# Altium schematic sheet PowerMeter_Meter.SchDoc: Power Meter - Measaurement
size A4; Author: SFARA, Gonzalo Agustín; CompanyName: Introducción al Diseño de Circuitos Impresos; Organization: UTN FRBA; Revision: 02; SheetNumber: 3; SheetTotal: 5
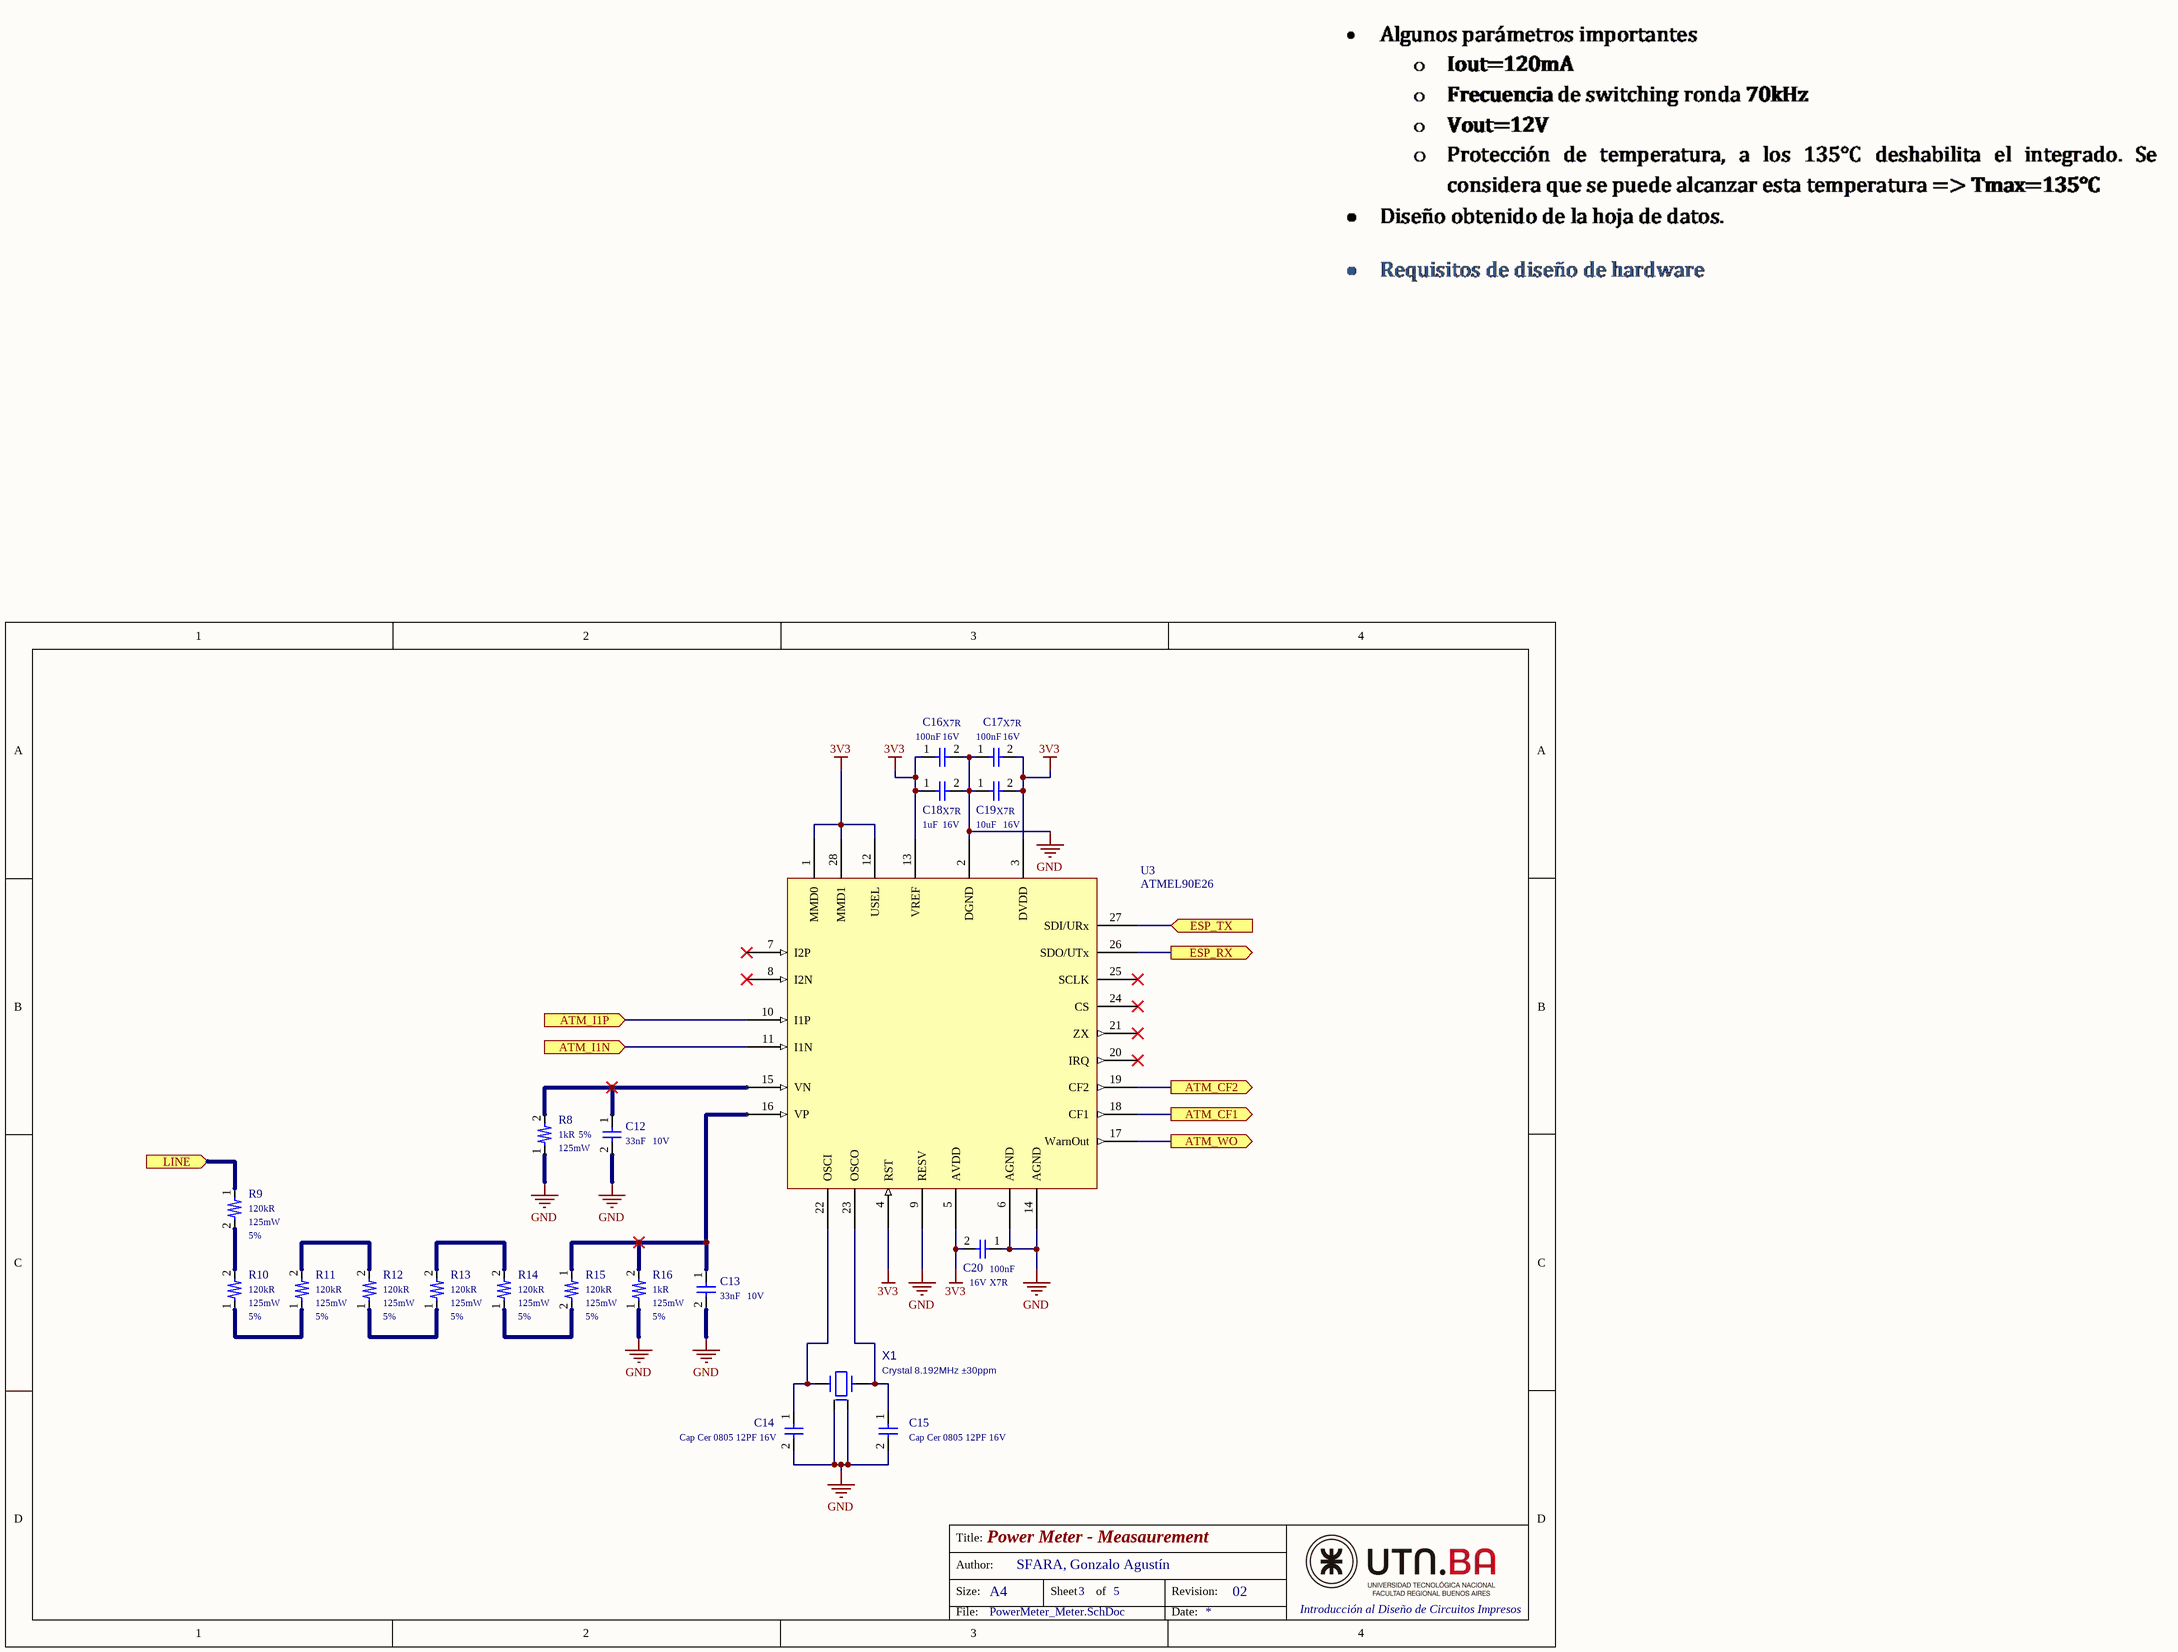
[diagram p0: PowerMeter_Meter.SchDoc]

## Parts
C12  Capacitance: 33nF  Voltage Rating (DC): 10V  [C_0805]  (hidden comment: CAP  Ceramic 33nF 16V)
C13  Capacitance: 33nF  Voltage Rating (DC): 10V  [C_0805]  (hidden comment: CAP  Ceramic 33nF 16V)
C14  Cap Cer 0805 12PF 16V  [C_0805]
C15  Cap Cer 0805 12PF 16V  [C_0805]
C16  Capacitance: 100nF  Voltage Rating (DC): 16V  Dielectric: X7R  [C_0805]  (hidden comment: CAP Ceramic  0.1uF 16V X7R)
C17  Capacitance: 100nF  Voltage Rating (DC): 16V  Dielectric: X7R  [C_0805]  (hidden comment: CAP Ceramic  0.1uF 16V X7R)
C18  Capacitance: 1uF  Dielectric: X7R  Voltage Rating: 16V  [C_0805]  (hidden comment: CAP Ceramic  1uF 16V X7R)
C19  Capacitance: 10uF  Dielectric: X7R  Voltage Rating: 16V  [C_1206]  (hidden comment: CAP Ceramic  10uF 16V X7R)
C20  Capacitance: 100nF  Voltage Rating (DC): 16V  Dielectric: X7R  [C_0805]  (hidden comment: CAP Ceramic  0.1uF 16V X7R)
R8  Resistance: 1kR  Tolerance: 5%  Max Power Dissipation: 125mW  [R_0805]  (hidden comment: RES 1kOhm 5% 1/8W)
R9  Resistance: 120kR  Tolerance: 5%  Max Power Dissipation: 125mW  [R_0805]  (hidden comment: RES 120kOhm 5% 1/8W)
R10  Resistance: 120kR  Tolerance: 5%  Max Power Dissipation: 125mW  [R_0805]  (hidden comment: RES 120kOhm 5% 1/8W)
R11  Resistance: 120kR  Tolerance: 5%  Max Power Dissipation: 125mW  [R_0805]  (hidden comment: RES 120kOhm 5% 1/8W)
R12  Resistance: 120kR  Tolerance: 5%  Max Power Dissipation: 125mW  [R_0805]  (hidden comment: RES 120kOhm 5% 1/8W)
R13  Resistance: 120kR  Tolerance: 5%  Max Power Dissipation: 125mW  [R_0805]  (hidden comment: RES 120kOhm 5% 1/8W)
R14  Resistance: 120kR  Tolerance: 5%  Max Power Dissipation: 125mW  [R_0805]  (hidden comment: RES 120kOhm 5% 1/8W)
R15  Resistance: 120kR  Tolerance: 5%  Max Power Dissipation: 125mW  [R_0805]  (hidden comment: RES 120kOhm 5% 1/8W)
R16  Resistance: 1kR  Tolerance: 5%  Max Power Dissipation: 125mW  [R_0805]  (hidden comment: RES 120kOhm 5% 1/8W)
U3  ATMEL90E26  [ATMEL90E26]
X1  Crystal 8.192MHz ±30ppm  [ABM3C]

## Ports
ATM_CF1 (out), ATM_CF2 (out), ATM_I1N (in), ATM_I1P (in), ATM_WO (out), ESP_RX (out), ESP_TX (in), LINE (in)

## Nets
3V3: C16.1 C17.2 C18.1 C19.2 C20.2 U3.1(MMD0) U3.3(DVDD) U3.4(RST) U3.5(AVDD) U3.12(USEL) U3.13(VREF) U3.28(MMD1)
GND: C12.2 C13.2 C14.2 C15.2 C16.2 C17.1 C18.2 C19.1 C20.1 R8.1 R16.1 U3.2(DGND) U3.6(AGND) U3.9(RESV) U3.14(AGND) X1.2 X1.4
ATM_CF1: U3.18(CF1) ; port ATM_CF1
ATM_CF2: U3.19(CF2) ; port ATM_CF2
ATM_I1N: U3.11(I1N) ; port ATM_I1N
ATM_I1P: U3.10(I1P) ; port ATM_I1P
ATM_WO: U3.17(WarnOut) ; port ATM_WO
ESP_RX: U3.26(SDO/UTx) ; port ESP_RX
ESP_TX: U3.27(SDI/URx) ; port ESP_TX
LINE: R9.1 ; port LINE
NetC12_1: C12.1 R8.2 U3.15(VN)
NetC13_1: C13.1 R15.1 R16.2 U3.16(VP)
NetC14_1: C14.1 U3.22(OSCI) X1.3
NetC15_1: C15.1 U3.23(OSCO) X1.1
NetR9_2: R9.2 R10.2
NetR10_1: R10.1 R11.1
NetR11_2: R11.2 R12.2
NetR12_1: R12.1 R13.1
NetR13_2: R13.2 R14.2
NetR14_1: R14.1 R15.2

Not connected (* = marked no-connect by the designer): U3 7(I2P)* 8(I2N)* 20(IRQ)* 21(ZX)* 24(CS)* 25(SCLK)*

## Notes on the sheet
- Title:
- Size:
- Author:
- A4
- Sheet
- of
- Revision:
- File:
- Date:

## Library data of the parts
C12 C13 = CAP_NP: Multilayer Ceramic Capacitors MLCC - SMD/SMT 0805 0.033uF 10volts Y5V +80-20%; Manufacturer: Vishay Vitramon; Manufacturer Part Number: VJ0805V333ZXQPW1BC; Dielectric Material: Tantalum; Tolerance: 80%; Supplier 1: Digi-Key; Supplier Part Number 1: VJ0805V333ZXQPW1BC-ND; RoHS: Yes; Category: Ceramic Capacitors; Mount: Surface Mount; Case/Package: 0805; Case Code (Imperial): 0805; Case Code (Metric): 2012; Min Operating Temperature: -25°C; Max Operating Temperature: 85°C; Packaging: Tape and Reel; Package Quantity: 15000; Dielectric: Y5V; Termination: SMD/SMT; Series: VJ W1BC; Construction: Flat; Length: 2mm; Width: 1.25mm; Height: 1.45mm; Depth: 1.25mm; Radiation Hardening: No; Lead Free: Lead Free; RoHS Compliant: Yes; ComponentLink1URL: https://datasheet.ciiva.com/11582/vjw1bcbascomseries-11582806.pdf?src-supplier=Avnet; ComponentLink1Description: https://datasheet.ciiva.com/11582/vjw1bcbascomseries-11582806.pdf?src-supplier=Avnet
C14 C15 = CAP_NP: Cap Cer 0805 12PF 16V Ultra Stab; Manufacturer: KEMET; Manufacturer Part Number: C0805C120K4HAC7800; Supplier 1: Digi-Key; Supplier Part Number 1: C0805C120K4HAC7800-ND; RoHS: No; Category: Ceramic Capacitors; Pricing 1: 24000=0,00982 (USD)
C16 C17 C20 = CAP_NP: Cap Ceramic 0.1uF 16V X7R 10% SMD 0805 125C Paper T/R; Manufacturer: Yageo; Manufacturer Part Number: CC0805KPX7R7BB104; Supplier 1: Digi-Key; Supplier Part Number 1: 13-CC0805KPX7R7BB104TR-ND; RoHS: Yes; Category: Ceramic Capacitors; Pricing 1: 60000=0,01497 (USD); Case/Package: 0805; Case Code (Imperial): 0805; Case Code (Metric): 2012; Weight: 0.000194oz; Min Operating Temperature: -55°C; Max Operating Temperature: 125°C; Tolerance: 10%; Packaging: Tape and Reel; Termination: SMD/SMT; Resistor Type: Ceramic; Lead Free: Lead Free; Halogen Free: Halogen Free; RoHS Compliant: Yes; ComponentLink1URL: https://datasheet.ciiva.com/13265/upy-gphc-x7r-6-3v-to-50v-8-12304-13265229.pdf?src-supplier=Mouser; ComponentLink1Description: https://datasheet.ciiva.com/13265/upy-gphc-x7r-6-3v-to-50v-8-12304-13265229.pdf?src-supplier=Mouser
C18 = CAP_NP: Cap Ceramic 1uF 16V X7R 10% Pad SMD 0805 125C T/R; Manufacturer: Samsung; Manufacturer Part Number: CL21B105KOFNNNF; Supplier 1: RSComponents; Supplier Part Number 1: 7665607; RoHS: Yes; Category: Ceramic Capacitors; Stock 1: 10000; Pricing 1: 10000=0,01200, 30000=0,01200, 50000=0,01100, 100000=0,01100, 250000=0,01000, 10000=0,00900, 30000=0,00900, 50000=0,00800, 100000=0,00800, 250000=0,00700 (USD); Mount: Surface Mount; Case/Package: 0805; Material: Ceramic; Min Operating Temperature: -55°C; Max Operating Temperature: 125°C; Tolerance: 10%; Packaging: Tape and Reel; Package Quantity: 10000; Voltage: 16V; Voltage Rating (DC): 16V; Series: CL; Construction: Flat; Length: 2mm; Width: 0.049inch; Height: 1.25mm; Thickness: 0.053inch; Depth: 1.25mm; Radiation Hardening: No; Lead Free: Lead Free; ComponentLink1URL: https://datasheet.ciiva.com/15195/getdatasheetpartid-359322-15195881.pdf?src-supplier=Verical; ComponentLink1Description: https://datasheet.ciiva.com/15195/getdatasheetpartid-359322-15195881.pdf?src-supplier=Verical; ComponentLink2URL: https://datasheet.ciiva.com/29199/455923-da-01-en-vs-kondensator-0805-29199045.pdf?src-supplier=Conrad; ComponentLink2Description: https://datasheet.ciiva.com/29199/455923-da-01-en-vs-kondensator-0805-29199045.pdf?src-supplier=Conrad; ComponentLink3URL: https://datasheet.ciiva.com/16290/cl05b104kq5nnnc-16290394.pdf?src-supplier=Future+Electronics; ComponentLink3Description: https://datasheet.ciiva.com/16290/cl05b104kq5nnnc-16290394.pdf?src-supplier=Future+Electronics; ComponentLink4URL: https://datasheet.ciiva.com/26310/mlcc-catalogdownload2013-eng-26310168.pdf?src-supplier=Distrelec; ComponentLink4Description: https://datasheet.ciiva.com/26310/mlcc-catalogdownload2013-eng-26310168.pdf?src-supplier=Distrelec
C19 = CAP_NP: CL31 Series 1206 10 uF 16 V ±10% Tolerance X7R Multilayer Ceramic Capacitor; Manufacturer: Samsung; Manufacturer Part Number: CL31B106KOHNNNF; Value: *; Supplier 1: Future Electronics; Supplier Part Number 1: 5039552; RoHS: Yes; Category: Ceramic Capacitors; Stock 1: 2000; Pricing 1: 8000=0,04240, 16000=0,03440, 24000=0,03410, 32000=0,03390 (USD); Mount: Surface Mount; Case/Package: 1206; Min Operating Temperature: -55°C; Max Operating Temperature: 125°C; Tolerance: 10%; Packaging: Tape and Reel; Package Quantity: 8000; Voltage Rating (DC): 16V; Series: CL; Construction: Flat; Length: 3.2mm; Width: 0.063inch; Height: 1.6mm; Thickness: 0.071inch; Depth: 1.6mm; Radiation Hardening: No; Lead Free: Lead Free; RoHS Compliant: Yes; ComponentLink1URL: https://datasheet.ciiva.com/25728/cl31b106kohnnnf-25728936.pdf?src-supplier=Digi-Key; ComponentLink1Description: https://datasheet.ciiva.com/25728/cl31b106kohnnnf-25728936.pdf?src-supplier=Digi-Key
R8 R16 = RES: Anti-Sulfurated Chip Resistor Thick Film 0805 1kOhm 5% Paper T/R; Manufacturer: Yageo; Manufacturer Part Number: AF0805JR-071KL; Temperature Coefficient: 100ppm/°C; Supplier 1: Digi-Key; Supplier Part Number 1: AF0805JR-071KL-ND; RoHS: Yes; Category: Chip SMD Resistors; Pricing 1: 5000=0,00940 (USD); Case/Package: 0805; Min Operating Temperature: -55°C; Max Operating Temperature: 155°C; Packaging: Tape and Reel; Resistor Type: Thick Film; Number of Terminations: 2; Features: Moisture Resistant,Anti-Sulfur; Length: 0.079inch; Width: 0.049inch; Height: 0.024inch; RoHS Compliant: Yes; ComponentLink1URL: http://www.yageo.com/documents/recent/PYu-AF_51_RoHS_L_5.pdf?src-supplier=Digi-Key; ComponentLink1Description: http://www.yageo.com/documents/recent/PYu-AF_51_RoHS_L_5.pdf?src-supplier=Digi-Key
R9-R15 = RES: Chip Resistor Automotive Grade Thick Film 0805 120kOhm 5% Paper T/R; Manufacturer: Yageo; Manufacturer Part Number: AC0805JR-07120KL; Voltage Rating: 150V; Temperature Coefficient: 100ppm/°C; Supplier 1: Arrow Electronics; Supplier Part Number 1: AC0805JR-07120KL; RoHS: Yes; Category: Chip SMD Resistors; Stock 1: 15000; Pricing 1: 5000=0,00560, 10000=0,00470 (USD); Case/Package: 0805; Case Code (Imperial): 0805; Case Code (Metric): 2012; Min Operating Temperature: -55°C; Max Operating Temperature: 155°C; Power Rating: 125mW; Packaging: Tape and Reel; Resistor Type: Thick Film; Number of Terminations: 2; Termination: SMD/SMT; Features: Moisture Resistant,Automotive AEC-Q200; Series: AC; Length: 0.079inch; Width: 0.049inch; Height: 0.024inch; RoHS Compliant: Yes; ComponentLink1URL: http://www.mouser.com/ds/2/447/yageodocoutput-1111992.pdf?src-supplier=Mouser; ComponentLink1Description: http://www.mouser.com/ds/2/447/yageodocoutput-1111992.pdf?src-supplier=Mouser; ComponentLink2URL: http://www.yageo.com/NewPortal/yageodocoutput?fileName=/pdf/R-Chip/PYu-AC_51_RoHS_L_6.pdf&src-supplier=Digi-Key; ComponentLink2Description: http://www.yageo.com/NewPortal/yageodocoutput?fileName=/pdf/R-Chip/PYu-AC_51_RoHS_L_6.pdf&src-supplier=Digi-Key
U3 = ATMEL90E26: M90E26: 3.6 V Single-Phase High-Performance Wide-Span Energy Metering IC-SSOP-28; Manufacturer: Microchip / Atmel; Manufacturer Part Number: ATM90E26-YU-B; Max Supply Voltage: 3.6V; Min Supply Voltage: 2.8V; Conversion Rate: 8KS/s; Supplier 1: Newark; Supplier Part Number 1: 67X3998; RoHS: No; Category: Uncategorized; Mount: Surface Mount; Case/Package: SSOP; Number of Pins: 28; Min Operating Temperature: -40°C; Max Operating Temperature: 85°C; Packaging: Bulk; Type: Integrated Circuit (IC); Length: 10.33mm; Width: 5.38mm; Height: 1.78mm; RoHS Compliant: No; ComponentLink1URL: https://datasheet.ciiva.com/48477/atmel-46002-se-m90e26-datasheet-48477046.pdf?src-supplier=Avnet; ComponentLink1Description: https://datasheet.ciiva.com/48477/atmel-46002-se-m90e26-datasheet-48477046.pdf?src-supplier=Avnet
X1 = CRYSTAL_4P: Crystal 8.192MHz ±30ppm (Tol) ±50ppm (Stability) 12pF FUND 100Ohm Automotive 2-Pin Mini-CSMD T/R; Manufacturer: ECS International; Manufacturer Part Number: ECS-81.92-12-30Q-EN-TR; Supplier 1: Digi-Key; Supplier Part Number 1: XC3145CT-ND; RoHS: Yes; Stock 1: 5042; Pricing 1: 1=0,91000, 10=0,80500, 50=0,75240, 100=0,66500, 500=0,63000 (USD)